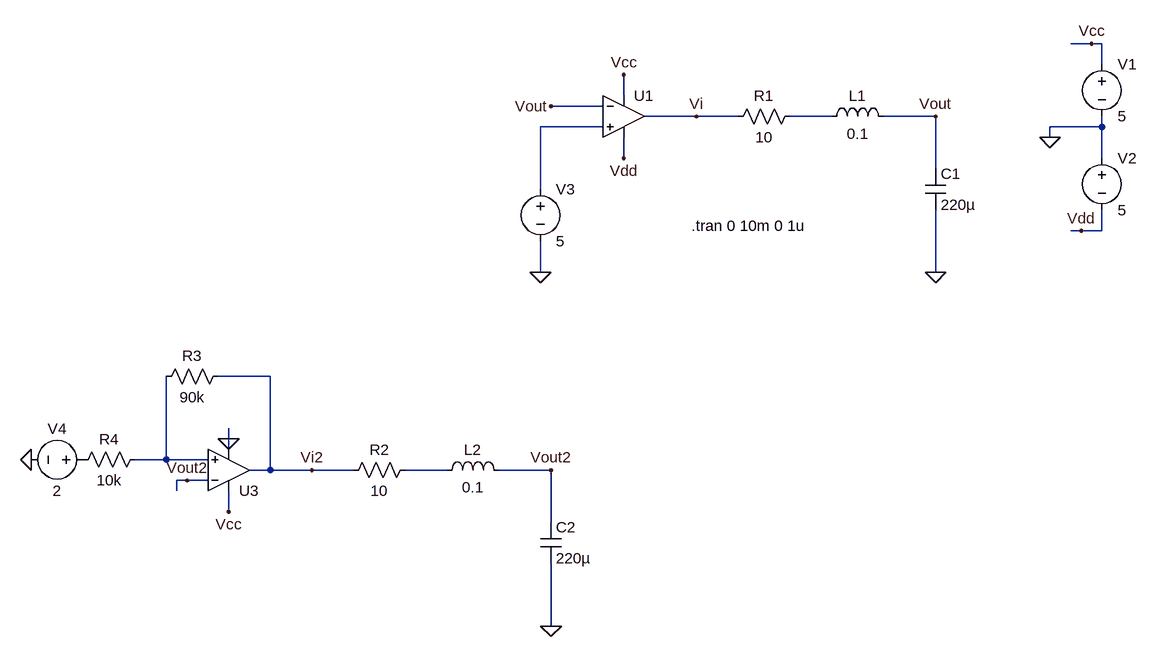
[diagram p0: schematic rlc_on_off.asc]
rlc_on_off.asc, the LTspice schematic file:
Version 4.1
SHEET 1 1640 964
WIRE 512 -48 480 -48
WIRE 528 -48 512 -48
WIRE 528 -16 528 -48
WIRE -208 32 -208 0
WIRE -240 48 -320 48
WIRE -96 64 -176 64
WIRE -32 64 -96 64
WIRE 112 64 48 64
WIRE 272 64 192 64
WIRE -240 80 -336 80
WIRE 528 80 528 64
WIRE 528 80 448 80
WIRE 448 96 448 80
WIRE -208 128 -208 96
WIRE 528 128 528 80
WIRE 272 144 272 64
WIRE -336 176 -336 80
WIRE 496 240 480 240
WIRE 528 240 528 208
WIRE 528 240 496 240
WIRE -336 304 -336 256
WIRE 272 304 272 208
WIRE -752 464 -832 464
WIRE -816 560 -816 544
WIRE -816 576 -816 560
WIRE -912 592 -912 464
WIRE -912 592 -960 592
WIRE -848 592 -912 592
WIRE -752 608 -752 464
WIRE -752 608 -784 608
WIRE -688 608 -752 608
WIRE -624 608 -688 608
WIRE -480 608 -544 608
WIRE -320 608 -400 608
WIRE -880 624 -896 624
WIRE -848 624 -880 624
WIRE -896 640 -896 624
WIRE -816 672 -816 640
WIRE -320 688 -320 608
WIRE -320 848 -320 752
FLAG 272 304 0
FLAG 448 96 0
FLAG 512 -48 Vcc
FLAG 496 240 Vdd
FLAG -208 0 Vcc
FLAG -208 128 Vdd
FLAG -336 304 0
FLAG 272 64 Vout
FLAG -320 48 Vout
FLAG -96 64 Vi
FLAG -320 848 0
FLAG -320 608 Vout2
FLAG -688 608 Vi2
FLAG -816 672 Vcc
FLAG -816 560 0
FLAG -880 624 Vout2
FLAG -1120 592 0
SYMBOL res 64 48 R90
WINDOW 0 0 56 VBottom 2
WINDOW 3 32 56 VTop 2
SYMATTR InstName R1
SYMATTR Value 10
SYMBOL ind 96 80 R270
WINDOW 0 32 56 VTop 2
WINDOW 3 5 56 VBottom 2
SYMATTR InstName L1
SYMATTR Value 0.1
SYMBOL cap 256 144 R0
SYMATTR InstName C1
SYMATTR Value 220µ
SYMBOL OpAmps\\UniversalOpAmp2 -208 64 R0
SYMATTR InstName U1
SYMBOL voltage 528 -32 R0
SYMATTR InstName V1
SYMATTR Value 5
SYMBOL voltage 528 112 R0
SYMATTR InstName V2
SYMATTR Value 5
SYMBOL voltage -336 160 R0
SYMATTR InstName V3
SYMATTR Value 5
SYMBOL res -528 592 R90
WINDOW 0 0 56 VBottom 2
WINDOW 3 32 56 VTop 2
SYMATTR InstName R2
SYMATTR Value 10
SYMBOL ind -496 624 R270
WINDOW 0 32 56 VTop 2
WINDOW 3 5 56 VBottom 2
SYMATTR InstName L2
SYMATTR Value 0.1
SYMBOL cap -336 688 R0
SYMATTR InstName C2
SYMATTR Value 220µ
SYMBOL res -816 448 R90
WINDOW 0 0 56 VBottom 2
WINDOW 3 32 56 VTop 2
SYMATTR InstName R3
SYMATTR Value 90k
SYMBOL res -944 576 R90
WINDOW 0 0 56 VBottom 2
WINDOW 3 32 56 VTop 2
SYMATTR InstName R4
SYMATTR Value 10k
SYMBOL OpAmps\\UniversalOpAmp2 -816 608 M180
SYMATTR InstName U3
SYMBOL voltage -1024 592 R90
WINDOW 0 -32 56 VBottom 2
WINDOW 3 32 56 VTop 2
SYMATTR InstName V4
SYMATTR Value 2
TEXT -104 232 Left 2 !.tran 0 10m 0 1u

The netlist it stands for:
* rlc_on_off.asc
R1 N001 Vi 10
L1 N001 Vout 0.1
C1 Vout 0 220µ
X§U1 N002 Vout Vcc Vdd Vi level2 Avol=1Meg GBW=10Meg Slew=10Meg Ilimit=25m Rail=0 Vos=0 En=0 Enk=0 In=0 Ink=0 Rin=500Meg  ; pins In+ In- V+ V- OUT
V1 Vcc 0 5
V2 0 Vdd 5
V3 N002 0 5
R2 N004 Vi2 10
L2 N004 Vout2 0.1
C2 Vout2 0 220µ
R3 Vi2 N003 90k
R4 N003 P001 10k
X§U3 N003 Vout2 Vcc 0 Vi2 level2 Avol=1Meg GBW=10Meg Slew=10Meg Ilimit=25m Rail=0 Vos=0 En=0 Enk=0 In=0 Ink=0 Rin=500Meg  ; pins In+ In- V+ V- OUT
V4 P001 0 2
.tran 0 10m 0 1u
.lib UniversalOpAmp2.lib
.backanno
.end